# Altium schematic sheet 3102_Sheet.SchDoc
size A
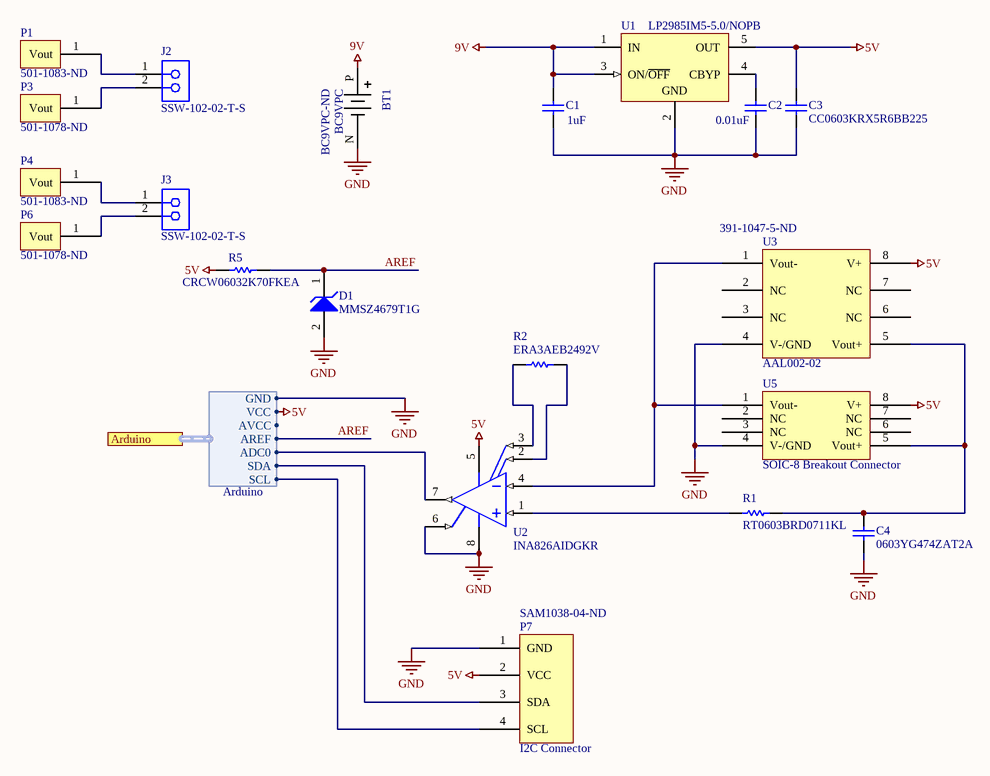
[diagram p0: 3102_Sheet.SchDoc]

## Parts
BT1  BC9VPC  Supplier Part Number 1: BC9VPC-ND  [*BAT_BC9VPC_BC9VPC(Primary)]
C1  1uF  [CAPC1608X90X30LL10T20]
C2  0.01uF  [CAPC1613X90X50LL10T25]
C3  CC0603KRX5R6BB225  [CAPC1608X90X40LL10T20]
C4  0603YG474ZAT2A  [CAPC1608X90X35ML15T15]
D1  MMSZ4679T1G  [ONSC-SOD-123-2-425-04_V]
J2  SSW-102-02-T-S  [SMTC-SSW-102-02-X-S]
J3  SSW-102-02-T-S  [SMTC-SSW-102-02-X-S]
P1  Supplier Part Number 1: 501-1083-ND  [Banana Jack Footprint]  (hidden comment: Model 1581 Red)
P3  Supplier Part Number 1: 501-1078-ND  [Banana Jack Footprint]  (hidden comment: Model 1581 Black)
P4  Supplier Part Number 1: 501-1083-ND  [Banana Jack Footprint]  (hidden comment: Model 1581 Red)
P6  Supplier Part Number 1: 501-1078-ND  [Banana Jack Footprint]  (hidden comment: Model 1581 Black)
P7  I2C Connector  Supplier Part Number 1: SAM1038-04-ND  [HDR1X4]
R1  Part Number: RT0603BRD0711KL  [J1-0603]  (hidden comment: Res3)
R2  ERA3AEB2492V  [RESC1608X55X30NL20T20]
R5  CRCW06032K70FKEA  [RESC1609X50X30ML10T20]
U1  LP2985IM5-5.0/NOPB  [DBV0005A_L]
U2  INA826AIDGKR  [DGK0008A_N]
U3  AAL002-02  Supplier Part Number 1: 391-1047-5-ND  [SO8_N]
U5  SOIC-8 Breakout Connector  [SOIC-8 Breakout Board]

## Ports
Arduino (harness Arduino)

## Harnesses
Arduino: SCL, SDA, ADC0, AREF, AVCC, VCC, GND

## Nets
5V: C3.2 P7.2(VCC) R5.1 U1.5(OUT) U2.5(VS-) U3.8(V+) U5.8(V+) ; port Arduino.VCC
9V: BT1.P(POS) C1.1 U1.1(IN) U1.3(ON/~{OFF})
GND: BT1.N(NEG) C1.2 C2.1 C3.1 C4.1 D1.2(A) P7.1(GND) U1.2(GND) U2.6(REF) U2.8(VS+) U3.4(V-/GND) U5.4(V-/GND) ; port Arduino.GND
AREF: D1.1(K) R5.2 ; port Arduino.AREF
NetC2_2: C2.2 U1.4(CBYP)
NetC4_2: C4.2 R1.2 U3.5(Vout+) U5.5(Vout+)
NetJ2_1: J2.1 P1.1(Vout)
NetJ2_2: J2.2 P3.1(Vout)
NetJ3_1: J3.1 P4.1(Vout)
NetJ3_2: J3.2 P6.1(Vout)
NetP7_3: P7.3(SDA) ; port Arduino.SDA
NetP7_4: P7.4(SCL) ; port Arduino.SCL
NetR1_1: R1.1 U2.1(IN-)
NetR2_1: R2.1 U2.2(RG)
NetR2_2: R2.2 U2.3(RG)
NetU2_4: U2.4(IN+) U3.1(Vout-) U5.1(Vout-)
NetU2_7: U2.7(VOUT) ; port Arduino.ADC0

Not connected (* = marked no-connect by the designer): U3 2(NC) 3(NC) 6(NC) 7(NC); U5 2(NC) 3(NC) 6(NC) 7(NC)

## Library data of the parts
BT1 = BC9VPC: BATTERY HOLDER 9V PC PIN; Manufacturer: Memory Protection Devices; MF: MPD; Number of Cells: 1; Price: None; Availability: Unavailable; MP: BC9VPC; SnapEDA_Link: https://www.snapeda.com/parts/BC9VPC/MPD/view-part/4389071/?ref=snap; Package: None; Value: *; Supplier 1: Digi-Key; Manufacturer Part Number: BC9VPC; RoHS: Yes; Category: Batteries and Accessories; Stock 1: 16110; Pricing 1: 1=1.98000, 10=1.67100, 100=1.38390, 500=1.19462, 1000=1.11629 (USD); Mount: Through Hole,PCB; Termination: PC Pin; Package Quantity: 100; Lead Free: Lead Free; ComponentLink1URL: https://datasheet.ciiva.com/3/bc9vpc-datasheet-3861.pdf?src-supplier=Digi-Key; ComponentLink1Description: https://datasheet.ciiva.com/3/bc9vpc-datasheet-3861.pdf?src-supplier=Digi-Key
C1 = CMP-2000-06093-1: Chip Capacitor, 1 uF, +/- 10%, 16 V, -55 to 125 degC, 0603 (1608 Metric), RoHS, Tape and Reel; Manufacturer: Samsung Electro-Mechanics; Dielectric: X7R; Capacitance: 1000000pF; Rated Voltage: 16V; Package Reference: 0603; Package Description: 2-Pin Surface Mount Device, Body 1.60 x 0.80 mm; Manufacturer URL: http://www.samsungsem.com/global/index.jsp; Datasheet URL: http://www.samsungsem.com/kr/support/product-search/mlcc/__icsFiles/afieldfile/2016/08/18/S_CL10B105KO8NNNC.pdf; Datasheet Version: 07/2016; Case Size/Dimension: 0603; Mounting Technology: SurfaceMount; Tolerance (%): ±10%
C2 = CMP-2006-02215-1: Part Number: CC0603KPX7R9BB103; Manufacturer: Yageo
C3 = CMP-2000-06073-1: Chip Capacitor, 2.2 uF, +/- 10%, 10 V, -55 to 85 degC, 0603 (1608 Metric), RoHS, Tape and Reel, CC0603KRX5R6BB225; Manufacturer: Yageo; Capacitance: 2.2µF; Online Catalog: CCSeries; Temperature Coefficient: X5R; Voltage - Rated: 10V; Featured Product: Yageo-HighCapacitanceMLCC; Other Names: 311-1451-6; Datasheet Version: Rev. 21, 01/2016; Applications: GeneralPurpose; Manufacturer URL: http://www.yageo.com/; Size / Dimension: 0.063"Lx0.031"W(1.60mmx0.80mm); Operating Temperature: -55°C~85°C; Tolerance: ±10%; Features: -; Mounting Type: SurfaceMount,MLCC; Packaging: Digi-Reel®; Series: CC; Height - Seated (Max): -; Family: CeramicCapacitors; Package Description: 2-Pin Surface Mount Device, Body 1.6 x 0.8 mm; Category: Capacitors; Datasheet URL: http://www.yageo.com/documents/recent/UPY-GPHC_X5R_4V-to-50V-21.pdf; Lead Spacing: -; Package Reference: 0603; Package / Case: 0603(1608Metric); Thickness (Max): 0.035"(0.90mm); Ratings: -; Standard Package: 1; Mounting Technology: SurfaceMount; Lead Style: -
C4 = CMP-2006-04546-1: Manufacturer: AVX Interconnect / Elco; Part Number: 0603YG474ZAT2A
D1 = CMP-1060-00509-1: Zener Voltage Regulator, 500 mW, 2-Pin SOD-123, Pb-Free, Tape and Reel; Manufacturer: On Semiconductor; P Max (W): 0.5; VZ Typ (V): 2; Packing: Tape and Reel; ComponentLink1Description: Manufacturer URL; DatasheetVersion: Rev. 9; PackageReference: SOD-123-2-425-04; ComponentLink3URL: http://www.onsemi.com/pub_link/Collateral/425-04.PDF; PackageDescription: 2-Pin SOD, Body 1.6 x 2.69 mm; ComponentLink3Description: Package Specification; ComponentLink2Description: Datasheet; ComponentLink1URL: http://www.onsemi.com/; PartNumber: MMSZ4679T1G; RoHS: Pb-Free; PackageVersion: Rev. G, 10/2009; ComponentLink2URL: http://www.onsemi.com/pub_link/Collateral/MMSZ4678T1-D.PDF; Mounting Technology: Surface Mount
J2 J3 = CMP-1023-00323-1: SQ Post Socket, Through-hole, Vertical, -55 to 105 degC, 2.54 mm Pitch, 2-Pin, Female, RoHS; Manufacturer: Samtec; Pitch: 2.54 mm; ComponentLink3Description: Package Specification; ComponentLink2Description: Datasheet; ComponentLink1Description: Manufacturer URL; PackageVersion: CA, 6/1987; DatasheetVersion: F-214; PackageDescription: Assembly, Socket Strip .016 X .031 Tail; ComponentLink2URL: http://www.samtec.com/documents/webfiles/pdf/SSW_TH.PDF; RoHS: True; ComponentLink3URL: http://www.samtec.com/documents/webfiles/cpdf/SSW-1XX-XX-XXX-X-XX-XXX-XX-MKT.pdf; ComponentLink1URL: http://www.samtec.com; PackageReference: SSW-102-02-X-S; Mounting Technology: Through-hole; Orientation: Vertical; Temperature Range: -55 to 105 degC; PartNumber: SSW-102-02-T-S
P1 P3 P4 P6 = Banana Plug: Pomona Model 1581; Supplier 1: Digi-Key
P7 = I2C Connector: SAMTEC - TSW-104-08-G-S - HEADER, 2.54MM, THT VERT, 4WAY; Number of Contacts: 4; Gender: Male; Connector Type: Male Pin; Max Current Rating: 7.6A; Max Voltage Rating (AC): 550V; Supplier 1: Digi-Key; Manufacturer: Samtec; Manufacturer Part Number: TSW-104-08-G-S; RoHS: Yes; Category: Headers and Wire Housings; Stock 1: 884; Pricing 1: 1=0.45000, 10=0.41800, 25=0.37600, 50=0.33400, 100=0.32020, 250=0.29232, 500=0.27840 (USD); Contact Plating: Gold; Contact Material: Bronze; Color: Black; Housing Material: Polyester; Housing Color: Black; Min Operating Temperature: -55°C; Max Operating Temperature: 125°C; Packaging: Bulk; Number of Rows: 1; Termination: Solder; Package Quantity: 1; Number of Positions: 4; Orientation: Vertical; Length: 10.16mm; Pitch: 2.54mm; Depth: 2.54mm; Width: 2.54mm; Contact Mating Length: 0.23inch; Radiation Hardening: No; REACH SVHC: No SVHC; Lead Free: Lead Free; ComponentLink1URL: https://datasheet.ciiva.com/6888/tsw-xxx-xx-xxx-x-xx-xxx-mkt-6888927.pdf?src-supplier=Digi-Key; ComponentLink1Description: https://datasheet.ciiva.com/6888/tsw-xxx-xx-xxx-x-xx-xxx-mkt-6888927.pdf?src-supplier=Digi-Key; ComponentLink2URL: https://datasheet.ciiva.com/10190/htsw-th-10190315.pdf?src-supplier=Avnet; ComponentLink2Description: https://datasheet.ciiva.com/10190/htsw-th-10190315.pdf?src-supplier=Avnet
R1 = CMP-2000-04350-1: Manufacturer: Yageo
R2 = CMP-2000-03181-1: CRCW06032K67FKEA; Manufacturer: Vishay Dale; Part Number: CRCW06032K67FKEA
R5 = CMP-2000-03182-1: Manufacturer: Vishay Dale; Part Number: CRCW06032K70FKEA
U1 = CMP-0062-02017-3: Micropower 150 mA Low-Noise Ultra Low-Dropout Regulator, 5-pin SOT-23, Pb-Free; Manufacturer: Texas Instruments; CompType: LDO IC; PowerWise: N; PackageTopMarking: L0UB*XTT; PinCount: 5; PackageReference: DBV0005A; RoHS: Y; ComponentLink1Description: Datasheet URL; PackageDescription: Molded SOT-23, .115 x .063 x .040 in Body, 5 Lead, .0375 in Pitch; ComponentLink1URL: http://www.ti.com/general/docs/lit/getliterature.tsp?genericPartNumber=LP2985-N&fileType=pdf
U2 = CMP-0944-00060-2: Precision, 200-uA Supply Current, 36-V Supply Instrumentation Amplifier, -40 to 125 degC, 8-pin SOP (DGK8), Green (RoHS & no Sb/Br); Manufacturer: Texas Instruments; Output Offset (+/-)(Max)(uV): 700; Input Offset Drift (+/-)(Max)(uV/Degrees Celsius): 2; Vs(Max)(V): 36; Non-Linearity (+/-)(Max)(%): 0.0005; Input Offset (+/-)(Max)(uV): 150; Output Offset Drift (+/-)(Max)(uV/Degrees Celsius): 10; Gain(V/V): 1 to 1000; CMRR(Min)(dB): 84; Noise at 1kHz(Typ)(nV/rt(Hz)): 18; Vs(Min)(V): 2.7; SubFamily: Single Supply; Number of Channels: 1; Input Bias Current (+/-)(Max)(nA): 65; Quiescent Current (+/-)(Typ)(mA): 0.2; ComponentLink1Description: Manufacturer URL; PartNumber: INA826AIDGKR; ComponentLink2URL: http://www.ti.com/general/docs/lit/getliterature.tsp?genericPartNumber=INA826&fileType=pdf; Code_JEDEC: MO-187; Eco-Plan: Green (RoHS & no Sb/Br); ComponentLink3URL: http://www.ti.com/litv/pdf/mpds028d; Mounting Technology: Surface Mount; ComponentLink3Description: Package Specification; PackageReference: DGK0008A; ComponentLink2Description: Datasheet; DatasheetVersion: SBOS562E; ComponentLink1URL: http://www.ti.com/; PackageDescription: 8-Pin Thin Small Outline, Body 3 x 3 mm, Pitch 0.65 mm; PackageVersion: 4073329/E, 05/2006
U3 = AAL002-02: Sensor Magmtr Wheat Brdg 8SOIC; Manufacturer: NVE; Manufacturer Part Number: AAL002-02E; Resistance: 5.5kR; Output Type: Wheatstone Bridge; Sensing Method: Magnetoresistive; Min Supply Voltage: 1V; Max Supply Voltage: 24V; Supplier 1: Digi-Key; RoHS: Yes; Category: Magnetic Sensors; Stock 1: 111; Pricing 1: 1=13.85000, 5=12.15000, 10=10.93500, 25=9.72000, 50=8.99100, 100=7.77600, 500=7.29000, 1000=6.80400 (USD); Case/Package: SOIC; Number of Pins: 8; Min Operating Temperature: -50°C; Max Operating Temperature: 150°C; Package Quantity: 92; Packaging: Rail/Tube; REACH SVHC: No SVHC; ComponentLink1URL: http://www.nve.com/Downloads/analog_catalog.pdf?src-supplier=Digi-Key; ComponentLink1Description: http://www.nve.com/Downloads/analog_catalog.pdf?src-supplier=Digi-Key; ComponentLink2URL: http://www.nve.com/Downloads/analog_catalog.pdf?src-supplier=Element14; ComponentLink2Description: http://www.nve.com/Downloads/analog_catalog.pdf?src-supplier=Element14; ComponentLink3URL: http://www.nve.com/Downloads/analog_catalog.pdf?src-supplier=Farnell; ComponentLink3Description: http://www.nve.com/Downloads/analog_catalog.pdf?src-supplier=Farnell
U5 = SOIC-8 Breakout Connector: Supplier 1: Digi-Key; Supplier Part Number 1: A880AR-ND